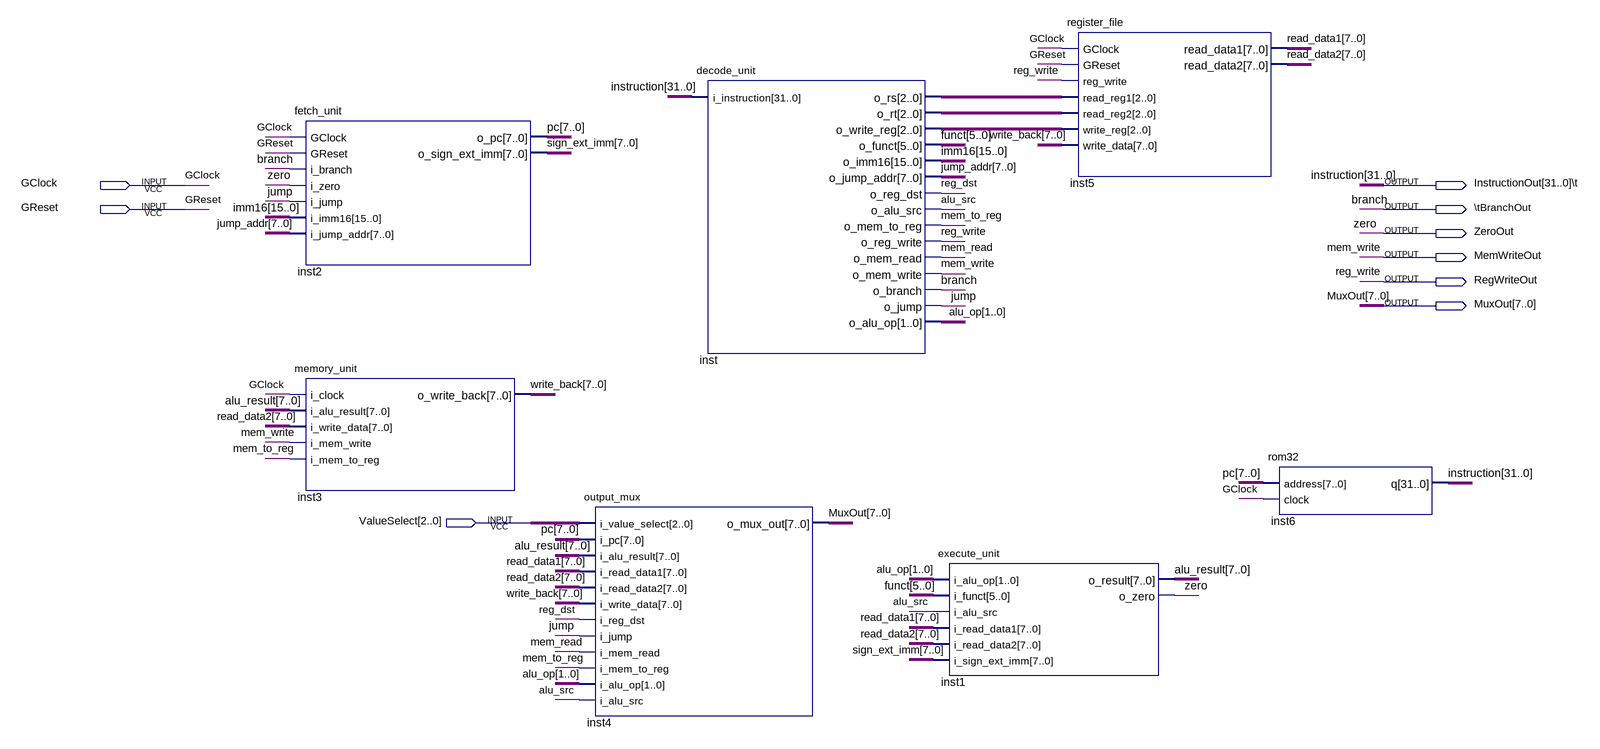
[diagram p0: schematic sheet]
// Quartus schematic processor_8bit_top.bdf as structural Verilog: 7 symbols, 9 pins
module processor_8bit_top (
  input  GClock,
  input  GReset,
  input  [2:0] ValueSelect,
  output \InstructionOut[31..0]\t ,
  output \\tBranchOut ,
  output ZeroOut,
  output MemWriteOut,
  output RegWriteOut,
  output [7:0] MuxOut
);

  wire alu_src, jump, mem_read, mem_to_reg, reg_dst;
  wire [1:0] alu_op;
  wire [2:0] inst_o_rs, inst_o_rt, inst_o_write_reg;
  wire [5:0] funct;
  wire [7:0] alu_result, jump_addr, pc, read_data1, read_data2, sign_ext_imm, write_back;
  wire [15:0] imm16;
  wire [31:0] instruction;

  fetch_unit inst2 (
    .GClock(GClock), .GReset(GReset), .i_branch(\\tBranchOut ), .i_zero(ZeroOut), .i_jump(jump),
    .i_imm16(imm16), .i_jump_addr(jump_addr), .o_pc(pc), .o_sign_ext_imm(sign_ext_imm));
  memory_unit inst3 (
    .i_clock(GClock), .i_alu_result(alu_result), .i_write_data(read_data2), .i_mem_write(MemWriteOut),
    .i_mem_to_reg(mem_to_reg), .o_write_back(write_back));
  output_mux inst4 (
    .i_value_select(ValueSelect), .i_pc(pc), .i_alu_result(alu_result), .i_read_data1(read_data1),
    .i_read_data2(read_data2), .i_write_data(write_back), .i_reg_dst(reg_dst), .i_jump(jump),
    .i_mem_read(mem_read), .i_mem_to_reg(mem_to_reg), .i_alu_op(alu_op), .i_alu_src(alu_src),
    .o_mux_out(MuxOut));
  decode_unit inst (
    .i_instruction(instruction), .o_rs(inst_o_rs), .o_rt(inst_o_rt), .o_write_reg(inst_o_write_reg),
    .o_funct(funct), .o_imm16(imm16), .o_jump_addr(jump_addr), .o_reg_dst(reg_dst), .o_alu_src(alu_src),
    .o_mem_to_reg(mem_to_reg), .o_reg_write(RegWriteOut), .o_mem_read(mem_read), .o_mem_write(MemWriteOut),
    .o_branch(\\tBranchOut ), .o_jump(jump), .o_alu_op(alu_op));
  execute_unit inst1 (
    .i_alu_op(alu_op), .i_funct(funct), .i_alu_src(alu_src), .i_read_data1(read_data1),
    .i_read_data2(read_data2), .i_sign_ext_imm(sign_ext_imm), .o_result(alu_result), .o_zero(ZeroOut));
  register_file inst5 (
    .GClock(GClock), .GReset(GReset), .reg_write(RegWriteOut), .read_reg1(inst_o_rs), .read_reg2(inst_o_rt),
    .write_reg(inst_o_write_reg), .write_data(write_back), .read_data1(read_data1), .read_data2(read_data2));
  rom32 inst6 (.address(pc), .clock(GClock), .q(instruction));

  // Other names for the same wires on the sheet: branch = \\tBranchOut ; mem_write = MemWriteOut;
  //   reg_write = RegWriteOut; zero = ZeroOut
endmodule
